# Altium schematic sheet PDMC-S01-V00-PowerDistributionModuleCard.SchDoc: PDMC Master
size A3; DrawnBy: Zoe Goodward; Organization: QUT Motorsport; Address1: O-120, Gardens Point; Address2: 2 George Street; Address3: Brisbane, QLD 4000; Address4: Australia; DocumentNumber: 1; Revision: 01; SheetNumber: 1; SheetTotal: 6; Version: 01; Project: Power Distribution Module Card; PageSetup: Record=PageOptions|CenterHorizontal=True|CenterVertical=True|PrintScale=0.97|XCorrection=1.00|YCorrection=1.00|PrintKind=0|BorderSize=5000000|LeftOffset=0|BottomOffset=0|Orientation=2|PaperLength=1000|PaperWidth=1000|Scale=100|PaperSource=7|PrintQuality=-4|MediaType=1|DitherType=10|PaperKind=A4|PrintScaleMode=1
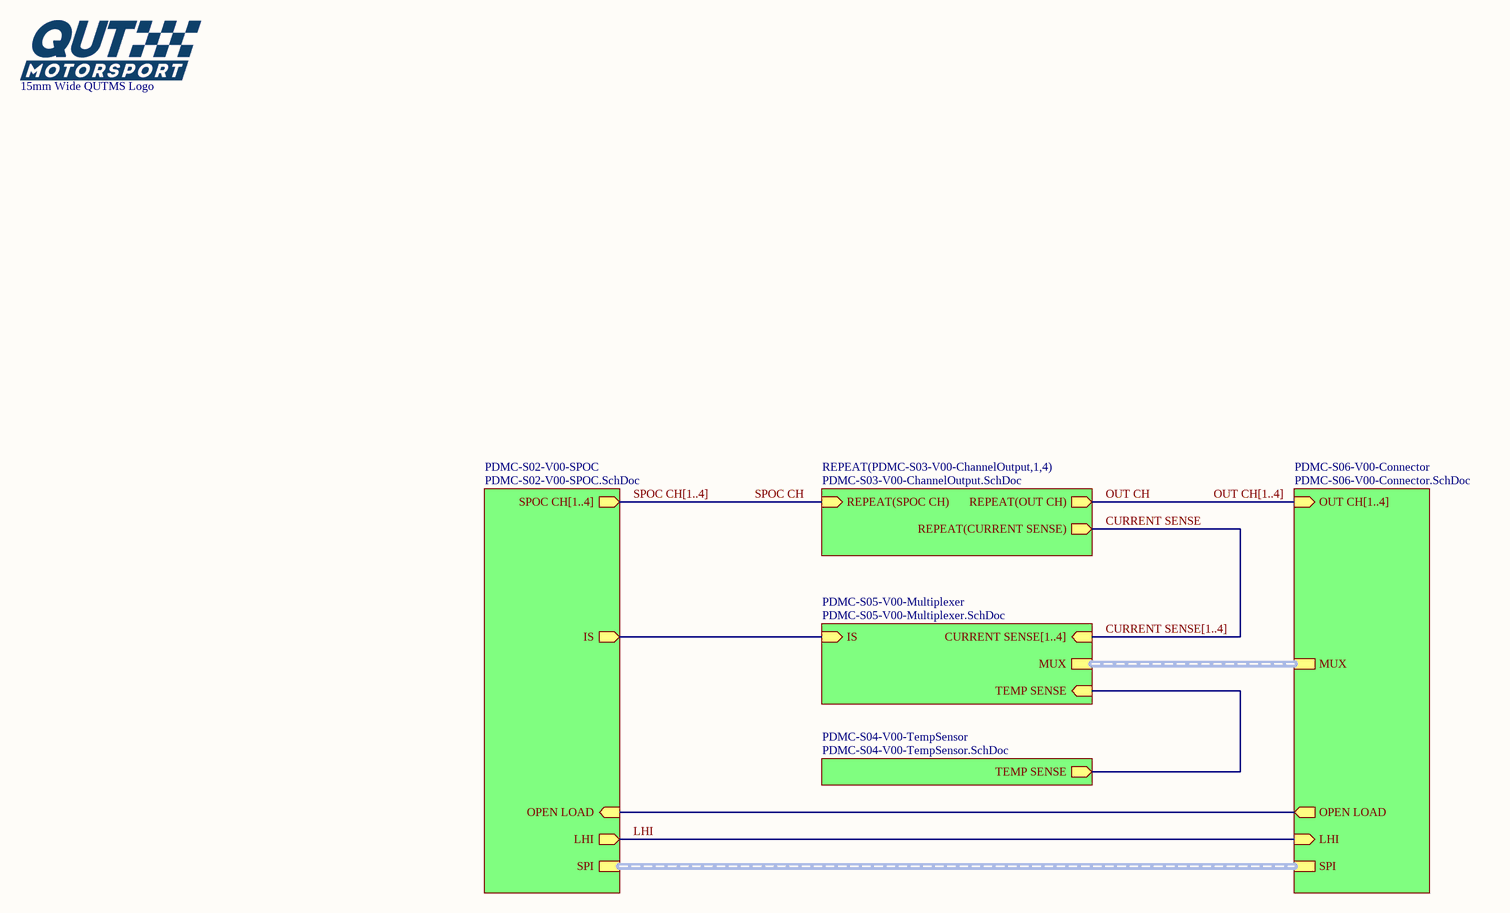
[diagram p0: PDMC-S01-V00-PowerDistributionModuleCard.SchDoc]

## Parts
LOGO1  15mm Wide QUTMS Logo  [QUTMS LOGO 15MM]

## Sub-sheets
PDMC-S02-V00-SPOC = PDMC-S02-V00-SPOC.SchDoc: SPOC CH[1..4] (out), IS (out), SPI (harness SPI), LHI (out), OPEN LOAD (in)
PDMC-S04-V00-TempSensor = PDMC-S04-V00-TempSensor.SchDoc: TEMP SENSE (out)
PDMC-S05-V00-Multiplexer = PDMC-S05-V00-Multiplexer.SchDoc: CURRENT SENSE[1..4] (in), IS (in), MUX (harness MUX), TEMP SENSE (in)
PDMC-S06-V00-Connector = PDMC-S06-V00-Connector.SchDoc: OUT CH[1..4] (in), MUX (harness MUX), SPI (harness SPI), LHI (in), OPEN LOAD (out)
REPEAT(PDMC-S03-V00-ChannelOutput,1,4) = PDMC-S03-V00-ChannelOutput.SchDoc: REPEAT(SPOC CH) (in), REPEAT(OUT CH) (out), REPEAT(CURRENT SENSE) (out)

## Nets
CURRENT SENSE: sheet REPEAT(PDMC-S03-V00-ChannelOutput,1,4)/REPEAT(CURRENT SENSE)
LHI: sheet PDMC-S02-V00-SPOC/LHI, sheet PDMC-S06-V00-Connector/LHI
OUT CH: sheet REPEAT(PDMC-S03-V00-ChannelOutput,1,4)/REPEAT(OUT CH)
SPOC CH: sheet REPEAT(PDMC-S03-V00-ChannelOutput,1,4)/REPEAT(SPOC CH)
(unnamed): sheet PDMC-S02-V00-SPOC/IS, sheet PDMC-S05-V00-Multiplexer/IS
(unnamed): sheet PDMC-S02-V00-SPOC/OPEN LOAD, sheet PDMC-S06-V00-Connector/OPEN LOAD
(unnamed): sheet PDMC-S05-V00-Multiplexer/TEMP SENSE, sheet PDMC-S04-V00-TempSensor/TEMP SENSE

## Buses and harness runs
bus CURRENT SENSE[1..4] = sheet PDMC-S05-V00-Multiplexer/CURRENT SENSE[1..4]
bus OUT CH[1..4] = sheet PDMC-S06-V00-Connector/OUT CH[1..4]
bus SPOC CH[1..4] = sheet PDMC-S02-V00-SPOC/SPOC CH[1..4]
harness sheet PDMC-S02-V00-SPOC/SPI = sheet PDMC-S06-V00-Connector/SPI
harness sheet PDMC-S05-V00-Multiplexer/MUX = sheet PDMC-S06-V00-Connector/MUX

## Notes on the sheet
- Revision History:
- Sheet Title:
- Rev
- Date
- Description
- Project:
- Size:
- Drawn By:
- A3
- Number:
- Revision:
- Sheet
- Version:
- of
- QUT Motorsport
- O-120, Gardens Point
- 2 George Street
- Brisbane, QLD 4000
- Australia
- Print Date:
- Print Time:
- File Name:

## Library data of the parts
LOGO1 = QUTMS Logo 15mm